# EAGLE design capacitor (EAGLE 9.6.2)
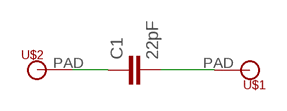
[diagram p0: schematic, sheet 1]

## Parts
C1  22pF  22PF-PTH-2.54MM-200V-5%  [CAP-PTH-2.54]
U$1  MICROBIT_PAD  [MICROBIT_PAD]
U$2  MICROBIT_PAD  [MICROBIT_PAD]

## Nets
N$1: C1.1 U$2.PAD
N$2: C1.2 U$1.PAD

## Library data of the parts
C1 = SparkFun-Capacitors:22PF: 22pF ceramic capacitors A capacitor is a passive two-terminal electrical component used to store electrical energy temporarily in an electric field.; PROD_ID: CAP-09128
U$1 U$2 = microbit:MICROBIT_PAD

## Board
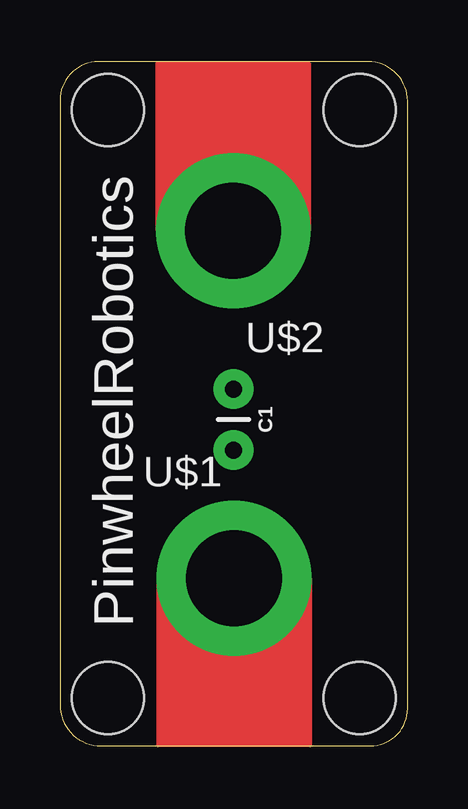
[diagram p1: board, top side]
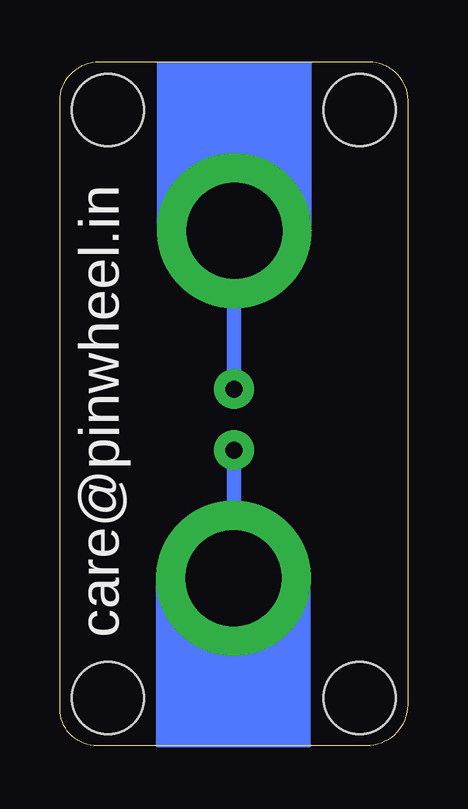
[diagram p2: board, bottom side, seen from below]

Size 14.5 x 28.5 mm. Coordinates in mm from the lower left corner, seen from the top.
Outline: 14.5,1.55 14.5,26.86 arc90 12.87,28.5 1.6,28.5 arc90 0,26.9 0,1.71 arc90 1.71,0 12.95,0 arc90 14.5,1.55
Copper layers (1*16): Top 0.035mm / dielectric 1.5mm / Bottom 0.035mm
Design rules "default": minimum track width 6mil, minimum drill 0.35mm, track to track 6mil, track to pad 6mil, pad to pad 6mil, via to via 6mil, smd to smd 6mil, copper to edge 40mil, drill to drill 6mil, minimum pad ring 10mil, minimum via ring 8mil, stop-mask expansion 4mil, vias tented up to drill 0mil, thermal gap 10mil
Holes 3 mm at 2,26.5 12.5,26.5 12.5,2 2,2

### Footprints (pad centres in the part's own frame; a part is rotated, then mirrored left to right if it is on the bottom)
CAP-PTH-2.54 = drill 0.7 pad 1.651: 1 -1.27,0; 2 1.27,0
MICROBIT_PAD = drill 4 pad 6.452: PAD 0,0

### Placement (x,y rotation side)
C1  7.24,13.59 270 top
U$1  7.26,6.99 0 top
U$2  7.23,21.46 180 top

### Tracks (layer width: path | path; a pad name or v marks a point on that pad's centre or on a via)
N$1
  Bottom 0.152: 7.25,15 C1.1 | 7.25,21.25 U$2.PAD
  Bottom 0.61: 7.25,21.25 7.25,15
N$2
  Bottom 0.152: 7.25,12.25 C1.2 | U$1.PAD
  Bottom 0.61: U$1.PAD 7.25,12.25

### Text on the board
tPlace: PinwheelRobotics
bPlace: care@pinwheel.in